# EAGLE design si1153-breakout (EAGLE 9.6.2)
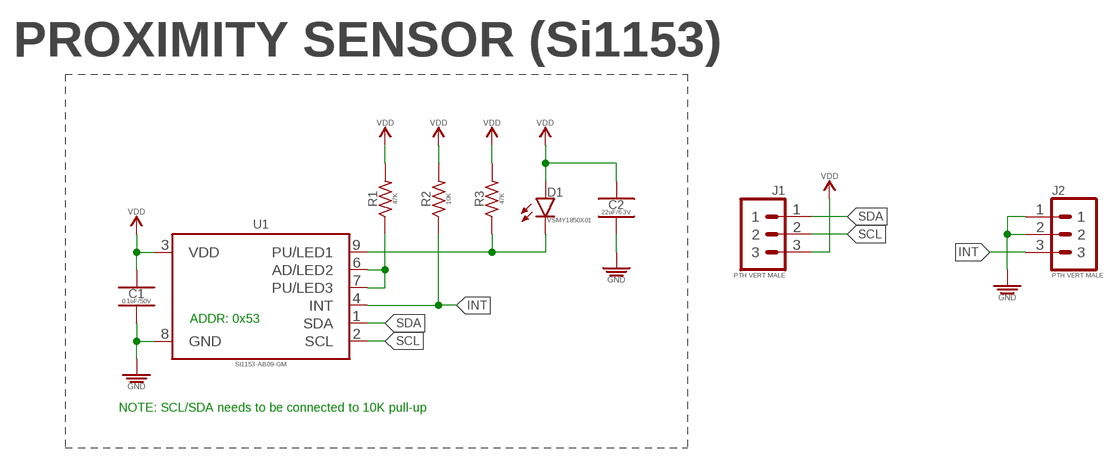
[diagram p0: schematic, sheet 1]

## Parts
C1  0.1uF/50V  0.1UF_SMD-0402_50V-10%  [CAPC1005X55_SMD-0402]
C2  22uF/6.3V  22UF_SMD-0402_50V-10%  [CAPC1005X55_SMD-0402]
D1  VSMY1850X01  [LEDC2012X120_LED-0805]
J1  PTH VERT MALE  1X03_PTH_VERT_MALE_2.54MM  [HDRV3W64P254_1X3_762X254X838B]
J2  PTH VERT MALE  1X03_PTH_VERT_MALE_2.54MM  [HDRV3W64P254_1X3_762X254X838B]
R1  47K  47KΩ_SMD-0402_1/16W-5%  [RESC1005X35_SMD-0402]
R2  10K  10KΩ_SMD-0402_1/16W-5%  [RESC1005X35_SMD-0402]
R3  47K  47KΩ_SMD-0402_1/16W-5%  [RESC1005X35_SMD-0402]
U1  SI1153-AB09-GM  SI1135  [QFN50P200X200X75-10N]

## Nets
GND: C1.2 C2.2 J2.1 J2.2 U1.8(GND)
INT: J2.3 R2.1 U1.4(INT)
N$1: R1.1 U1.6(AD/LED2) U1.7(PU/LED3)
N$2: D1.K R3.1 U1.9(PU/LED1)
SCL: J1.2 U1.2(SCL)
SDA: J1.1 U1.1(SDA)
VDD: C1.1 C2.1 D1.A J1.3 R1.2 R2.2 R3.2 U1.3(VDD)

## Notes on the sheet
- PROXIMITY SENSOR (Si1153)
- ADDR: 0x53
- NOTE: SCL/SDA needs to be connected to 10K pull-up

## Library data of the parts
C1 = _capacitors:0.1UF; DATASHEET: https://product.tdk.com/info/en/catalog/datasheets/mlcc_commercial_soft_en.pdf; DIST: Digikey; DISTLINK: https://www.digikey.com/products/en?keywords=445-173610-1-ND; DISTPN: 445-173610-1-ND; MFR: TDK Corporation; MPN: C1005X7R1H104K050BE
C2 = _capacitors:22UF; DATASHEET: http://weblib.samsungsem.com/mlcc/mlcc-ec-data-sheet.do?partNumber=CL05A226MQ5QUN; DIST: Digikey; DISTLINK: https://www.digikey.com/en/products/detail/samsung-electro-mechanics/CL05A226MQ5QUNC/5961318?s=N4IgTCBcDaIIxgOwDYC0yAcBmALKuqAcgCIgC6AvkA; DISTPN: 1276-6834-1-ND; MFR: Samsung Electro-Mechanics; MPN: CL05A226MQ5QUNC
D1 = _leds:VSMY1850X01; DATASHEET: https://www.vishay.com/docs/83317/vsmy1850.pdf; DIST: Digikey; DISTLINK: https://www.digikey.com/en/products/detail/vishay-semiconductor-opto-division/VSMY1850X01/3340207?s=N4IgTCBcDaIGoGUCyBNAjADgKwAYAaOaAwgCoC0AcgCIgC6AvkA; DISTPN: VSMY1850X01CT-ND; MFR: Vishay Semiconductor Opto Division; MPN: VSMY1850X01
J1 J2 = _connectors:1X03; DATASHEET: https://s3.amazonaws.com/catalogspreads-pdf/PAGE112-113%20.100%20MALE%20HDR.pdf; DIST: Digikey; DISTLINK: https://www.digikey.com/en/products/detail/sullins-connector-solutions/PEC03SAAN/859156?s=N4IgTCBcDaIMoEYAMCwFEC0SDMGByAIiALoC%2BQA; DISTPN: S1012E-03-ND; MFR: Sullins Connector Solutions; MPN: PEC03SAAN
R1 R3 = _resistors:47KΩ; DATASHEET: http://www.yageo.com/NewPortal/yageodocoutput?fileName=/pdf/R-Chip/PYu-AC_51_RoHS_L_6.pdf; DIST: Digikey; DISTLINK: YAG3547CT-ND; DISTPN: YAG3547CT-ND; MFR: Yageo; MPN: AC0402JR-0747KL
R2 = _resistors:10KΩ; DATASHEET: http://www.yageo.com/NewPortal/yageodocoutput?fileName=/pdf/R-Chip/PYu-RC_51_RoHS_P_0.pdf; DIST: Digikey; DISTLINK: https://www.digikey.com/products/en?keywords=YAG1281CT-ND; DISTPN: YAG1281CT-ND; MFR: Yageo; MPN: RC0402JR-0710KP
U1 = _sensors:SI113: SENSOR OPT 625NM/525NM AMB 10DFN; DATASHEET: https://www.silabs.com/documents/public/data-sheets/si115x-datasheet.pdf; DIST: Digikey; DISTLINK: https://www.digikey.com/en/products/detail/silicon-labs/SI1153-AB09-GM/9685360?s=N4IgTCBcDaIMxwGwFoCsBOAjO5A5AIiALoC%2BQA; DISTPN: 336-5919-ND; MFR: Silicon Labs; MPN: SI1153-AB09-GM

## Board
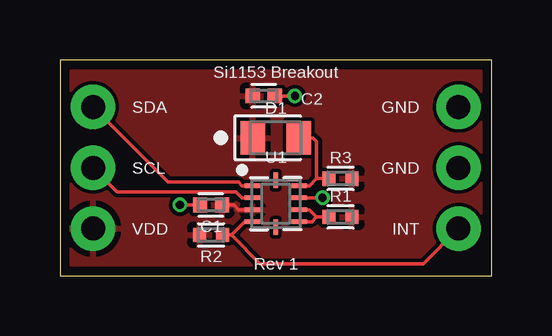
[diagram p1: board, top side]
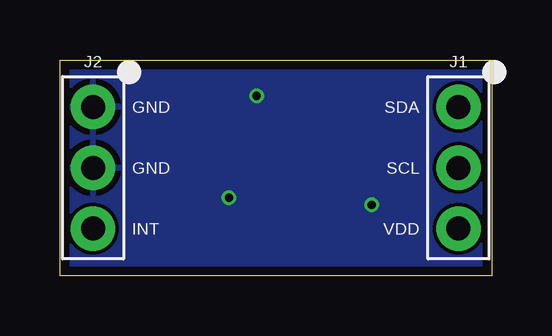
[diagram p2: board, bottom side, seen from below]

Size 18 x 9 mm. Coordinates in mm from the lower left corner, seen from the top.
Outline: 0,0 18,0 18,9 0,9 0,0
Copper layers (1*16): Top 0.035559375mm / dielectric 1.6mm / Bottom 0.035559375mm
Design rules "oshpark-2layer": minimum track width 6mil, minimum drill 10mil, track to track 6mil, track to pad 6mil, pad to pad 6mil, via to via 6mil, smd to smd 6mil, copper to edge 15mil, drill to drill 6mil, minimum pad ring 5mil, minimum via ring 5mil, stop-mask expansion 2.5mil, vias tented up to drill 0mil, thermal gap 10mil

### Footprints (pad centres in the part's own frame; a part is rotated, then mirrored left to right if it is on the bottom)
CAPC1005X55_SMD-0402 = smd 0.585 x 0.612: 1 -0.458,0; 2 0.458,0
LEDC2012X120_LED-0805 = smd 1.01 x 1.379: A -0.96,0; K 0.96,0
HDRV3W64P254_1X3_762X254X838B = drill 1 pad 1.85: 1 -2.54,0; 2 0,0; 3 2.54,0
RESC1005X35_SMD-0402 = smd 0.535 x 0.6: 1 -0.482,0; 2 0.482,0
QFN50P200X200X75-10N = smd 0.65 x 0.17: 1 -0.975,0.75; 2 -0.975,0.25; 3 -0.975,-0.25; 4 -0.975,-0.75; 6 0.975,-0.75; 7 0.975,-0.25; 8 0.975,0.25; 9 0.975,0.75 | smd 0.17 x 0.65: 5 0,-0.975; 10 0,0.975

### Placement (x,y rotation side)
C1  6.3,2.95 180 top
C2  8.5,7.5 0 top
D1  9,5.75 0 top
J1  1.38,4.5 270 bottom
J2  16.62,4.5 270 bottom
R1  11.7,2.45 0 top
R2  6.3,1.7 180 top
R3  11.7,4.05 0 top
U1  9,3 0 top

### Tracks (layer width: path | path; a pad name or v marks a point on that pad's centre or on a via)
GND  (via drill 0.35 pad 0.15)
  Top 0.152: U1.8 v10.95,3.25 | C1.2 v5,2.95 | C2.2 v9.8,7.5
  pour Bottom: 0,0 18,0 18,9 0,9
INT
  Top 0.152: U1.4 7.7,2.25 7.15,1.7 | R2.1 7.15,1.7 | 7.15,1.7 8.35,0.5 15.16,0.5 J2.3
N$1
  Top 0.152: U1.6 10.5,2.25 10.7,2.45 | 10.7,2.45 R1.1 | U1.7 10.4,2.75 10.7,2.45
N$2
  Top 0.152: U1.9 10.4,3.75 10.7,4.05 | D1.K 10.55,5.75 10.7,5.6 10.7,4.05 | R3.1 10.7,4.05
SCL
  Top 0.152: U1.2 7.6,3.25 7.35,3.5 2.38,3.5 J1.2
SDA
  Top 0.152: U1.1 7.6,3.75 7.45,3.9 4.52,3.9 J1.1
VDD
  Top 0.152: U1.3 7.45,2.75 7.25,2.95 C1.1
  pour Top: 0,0 18,0 18,9 0,9

### Text on the board
tPlace: Si1153 Breakout | SDA | GND | SCL | GND | VDD | INT | Rev 1
bPlace: SDA | GND | SCL | GND | VDD | INT